# Altium schematic sheet Sheet1.SchDoc
size A; SheetNumber: 1; SheetTotal: 1
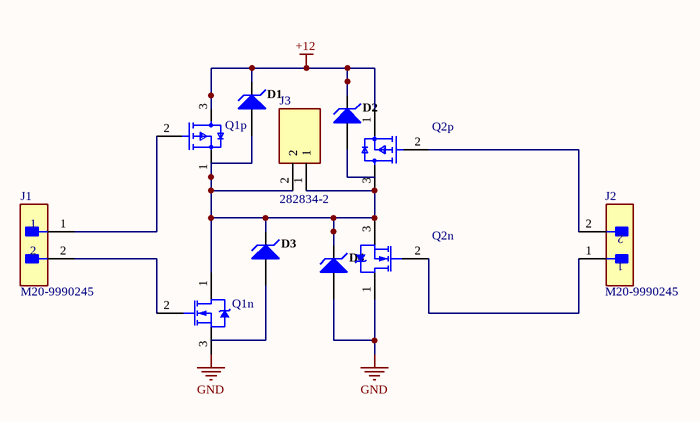
[diagram p0: Sheet1.SchDoc]

## Parts
D1  1N4732A  [FAIR-DO-41-2_V]  (value not drawn)
D2  1N4732A  [FAIR-DO-41-2_V]  (value not drawn)
D3  1N4732A  [FAIR-DO-41-2_V]  (value not drawn)
D4  1N4732A  [FAIR-DO-41-2_V]  (value not drawn)
J1  M20-9990245  [FP-M20-9990245-MFG]
J2  M20-9990245  [FP-M20-9990245-MFG]
J3  282834-2  [TE_282834-2]
Q1n  BS170  [ONSC-TO-92-3-29-11]  (value not drawn)
Q1p  VP2450N3-G  [FP-N3-MFG]  (value not drawn)
Q2n  BS170  [ONSC-TO-92-3-29-11]  (value not drawn)
Q2p  VP2450N3-G  [FP-N3-MFG]  (value not drawn)

## Nets
+12: D1.2(K) D2.2(K) Q1p.3(DRAIN) Q2p.1(SOURCE)
GND: D4.1(A) Q1n.3(S) Q2n.1(D)
NetD1_1: D1.1(A) D3.2(K) D4.2(K) J3.1 J3.2 Q1n.1(D) Q1p.1(SOURCE) Q2n.3(S) Q2p.3(DRAIN)
NetJ1_1: J1.1 Q1p.2(GATE)
NetJ1_2: J1.2 Q1n.2(G)
NetJ2_1: J2.1 Q2n.2(G)
NetJ2_2: J2.2 Q2p.2(GATE)

Not connected (* = marked no-connect by the designer): D2 1(A); D3 1(A)

## Library data of the parts
D1-D4 = CMP-0892-00030-1: Zener Diode, 4.7V, 1W, 5%, -65 to 200 degC, 2-Pin DO-41, Body 2.72 x 5.2 mm, RoHS; Manufacturer: Fairchild Semiconductor; VZ (Min.) (V): 4.465; ZZ (Max) (ohm): 8; VZ (Max.) (V): 4.935; PD (W): 1; IR (uA): 10; Test Current IZ (mA): 53; DatasheetVersion: Rev. H3; ComponentLink3Description: Package Specification; PartNumber: 1N4732A; PackageReference: DO-41-2; PackageVersion: Rev. 2; ComponentLink1Description: Manufacturer URL; Operating and Storage Temperature Range: -65 to 200 degC; PackageDescription: 2-Pin Axial leaded, Body 2.72 x 5.2 mm, Lead Spread 25.4 mm; ComponentLink2URL: http://www.fairchildsemi.com/ds/1N/1N4744A.pdf; Tolerance: 5%; ComponentLink2Description: Datasheet; Mounting Technology: Through Hole; RoHS: TRUE; ComponentLink3URL: http://www.fairchildsemi.com/dwg/DO/DO41A.pdf; ComponentLink1URL: http://www.fairchildsemi.com/
J1 J2 = CMP-15831-000105-1: CONN HEADER VERT 2POS 2.54MM; Working Voltage: 750V; Gender: Male; Number of Poles: 2; Current Rating: 3A; Mated Stacking Heights: 16.54mm; Contact Resistance: 25mR; Connector Type: Male Pin; Insulation Resistance: 10GR; Mating Cycles: 300; Voltage: 50V; Flammability Rating: UL94 V-0; Pitch: 2.54mm; Series: M20; Number of Contacts: 2; Height: 0.12inch; Min Operating Temperature: -40°C; Contact Finish - Mating: GOLD; Number of Positions: 2; Number of Rows: 1; Packaging: Bulk; Package Quantity: 1000; Voltage Rating (AC): 750V; Current: 3A; Mount: Through Hole; Case/Package: SIL; Orientation: Straight; Contact Shape: Square; Weight: 0.25lb; Radiation Hardening: No; Fastening Type: Pull; Length: 5.08mm; Depth: 2.54mm; Contact Mating Length: 0.24inch; Housing Material: Nylon; Reach SVHC Compliant: Yes; Insulation Material: Nylon; Color: Black; Width: 0.25inch; Insulation Color: Black; Contact Material: Brass; Contact Type: Male Pin; Termination: Solder; Max Operating Temperature: 105°C; Contact Plating: Gold; Housing Color: Black; Max Current Rating: 3A; Lead Pitch: 2.54mm
J3 = 282834-2: MF: {'manufacturer': u'TE Connectivity'}; Value: *; MP: 282834-2; Availability: Unavailable; Package: None; Price: None
Q1n Q2n = CMP-1058-00929-1: Small Signal MOSFET, 500 mA, 60 V, N-Channel, 3-Pin TO-92, Bulk Box; Manufacturer: On Semiconductor; VGS Max (V): 20; Configuration: Single; PD Max (W): 0.35; VGS(th) Max (V): 3; ID Max (A): 0.5; V(BR)DSS Min (V): 60; Channel Polarity: N Channel; PackageDescription: 3-Pin Transistor Outline, Body 4.825 x 3.685 mm, Pitch 1.27 mm; Package Type: TO-92; ComponentLink1Description: Manufacturer URL; ComponentLink1URL: http://www.onsemi.com/; DatasheetVersion: Rev. 6; ComponentLink3Description: Package Specification; PartNumber: BS170; ComponentLink2URL: http://www.onsemi.com/pub_link/Collateral/BS170-D.PDF; PackageVersion: Rev. AM; Mounting Technology: Through Hole; PackageReference: TO-92-3-29-11_AM_SL; ComponentLink2Description: Datasheet; ComponentLink3URL: http://www.onsemi.cn/pub_link/Collateral/2N6426-D.PDF; Packing: Bulk Box
Q1p Q2p = CMP-00252-47153691-1: VP2450N3-G Transistor MOSFET P-CH 500V 0.1A 3-Pin TO-92; Drain to Source Breakdown Voltage: -500V; Turn-On Delay Time: 10ns; Drain to Source Resistance: 30Ω; Number of Elements: 1; Rise Time: 25ns; Power Dissipation: 1W; Input Capacitance: 190pF; Continuous Drain Current (ID): -100mA; Max Power Dissipation: 740mW; Gate to Source Voltage (Vgs): 20V; Element Configuration: Single; Turn-Off Delay Time: 45ns; Ambient Temperature Range High: 150°C; Min Operating Temperature: -55°C; RoHS: Compliant; Radiation Hardening: No; Schedule B: 8541290080; Number of Channels: 1; Max Operating Temperature: 150°C; Height: 5.33mm; Case/Package: TO-92; Weight: 453.59237mg; NexarPartId: 47153691; Packaging: Bulk; Drain to Source Voltage (Vdss): -500V; Length: 5.21mm; Number of Pins: 3; Fall Time: 25ns; Rds On Max: 30Ω; Lifecycle Status: Production; Width: 4.19mm; Mount: Through Hole